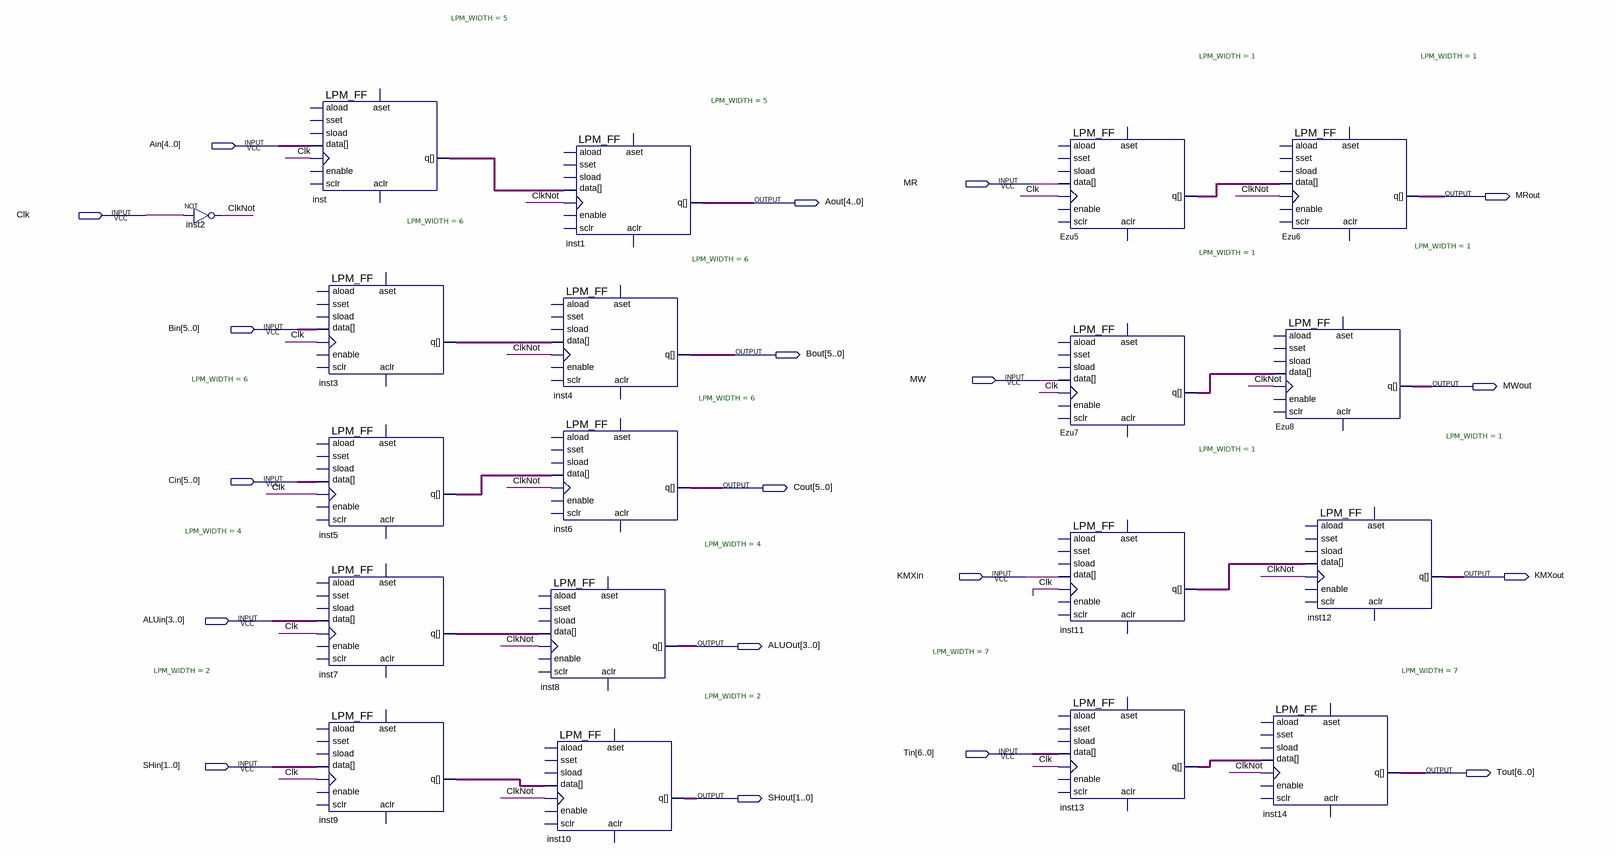
[diagram p0: schematic sheet]
// Quartus schematic MIR.bdf as structural Verilog: 19 symbols, 19 pins
module MIR (
  input  [4:0] Ain,
  input  MR,
  input  Clk,
  input  [5:0] Bin,
  input  MW,
  input  [5:0] Cin,
  input  KMXin,
  input  [3:0] ALUin,
  input  [6:0] Tin,
  input  [1:0] SHin,
  output MRout,
  output [4:0] Aout,
  output [5:0] Bout,
  output MWout,
  output [5:0] Cout,
  output KMXout,
  output [3:0] ALUOut,
  output [6:0] Tout,
  output [1:0] SHout
);

  wire ClkNot, Ezu5_q, Ezu7_q, inst11_q;
  wire [1:0] inst9_q;
  wire [3:0] inst7_q;
  wire [4:0] inst_q;
  wire [5:0] inst3_q, inst5_q;
  wire [6:0] inst13_q;

  not inst2 (ClkNot, Clk);
  LPM_FF #(.LPM_WIDTH(5)) inst (
    .clock(Clk), .data(Ain), .q(inst_q));  // open: enable, aload, sset, sload, aset, sclr, aclr
  LPM_FF #(.LPM_WIDTH(6)) inst3 (
    .clock(Clk), .data(Bin), .q(inst3_q));  // open: enable, aload, sset, sload, aset, sclr, aclr
  LPM_FF #(.LPM_WIDTH(6)) inst5 (
    .clock(Clk), .data(Cin), .q(inst5_q));  // open: enable, aload, sset, sload, aset, sclr, aclr
  LPM_FF #(.LPM_WIDTH(4)) inst7 (
    .clock(Clk), .data(ALUin), .q(inst7_q));  // open: enable, aload, sset, sload, aset, sclr, aclr
  LPM_FF #(.LPM_WIDTH(2)) inst9 (
    .clock(Clk), .data(SHin), .q(inst9_q));  // open: enable, aload, sset, sload, aset, sclr, aclr
  LPM_FF #(.LPM_WIDTH(6)) inst4 (
    .clock(ClkNot), .data(inst3_q), .q(Bout));  // open: enable, aload, sset, sload, aset, sclr, aclr
  LPM_FF #(.LPM_WIDTH(6)) inst6 (
    .clock(ClkNot), .data(inst5_q), .q(Cout));  // open: enable, aload, sset, sload, aset, sclr, aclr
  LPM_FF #(.LPM_WIDTH(4)) inst8 (
    .clock(ClkNot), .data(inst7_q), .q(ALUOut));  // open: enable, aload, sset, sload, aset, sclr, aclr
  LPM_FF #(.LPM_WIDTH(2)) inst10 (
    .clock(ClkNot), .data(inst9_q), .q(SHout));  // open: enable, aload, sset, sload, aset, sclr, aclr
  LPM_FF #(.LPM_WIDTH(5)) inst1 (
    .clock(ClkNot), .data(inst_q), .q(Aout));  // open: enable, aload, sset, sload, aset, sclr, aclr
  LPM_FF #(.LPM_WIDTH(1)) Ezu5 (
    .clock(Clk), .data(MR), .q(Ezu5_q));  // open: enable, aload, sset, sload, aset, sclr, aclr
  LPM_FF #(.LPM_WIDTH(1)) Ezu7 (
    .clock(Clk), .data(MW), .q(Ezu7_q));  // open: enable, aload, sset, sload, aset, sclr, aclr
  LPM_FF #(.LPM_WIDTH(1)) inst11 (
    .clock(Clk), .data(KMXin), .q(inst11_q));  // open: enable, aload, sset, sload, aset, sclr, aclr
  LPM_FF #(.LPM_WIDTH(7)) inst13 (
    .clock(Clk), .data(Tin), .q(inst13_q));  // open: enable, aload, sset, sload, aset, sclr, aclr
  LPM_FF #(.LPM_WIDTH(7)) inst14 (
    .clock(ClkNot), .data(inst13_q), .q(Tout));  // open: enable, aload, sset, sload, aset, sclr, aclr
  LPM_FF #(.LPM_WIDTH(1)) Ezu6 (
    .clock(ClkNot), .data(Ezu5_q), .q(MRout));  // open: enable, aload, sset, sload, aset, sclr, aclr
  LPM_FF #(.LPM_WIDTH(1)) Ezu8 (
    .clock(ClkNot), .data(Ezu7_q), .q(MWout));  // open: enable, aload, sset, sload, aset, sclr, aclr
  LPM_FF #(.LPM_WIDTH(1)) inst12 (
    .clock(ClkNot), .data(inst11_q), .q(KMXout));  // open: enable, aload, sset, sload, aset, sclr, aclr
endmodule
